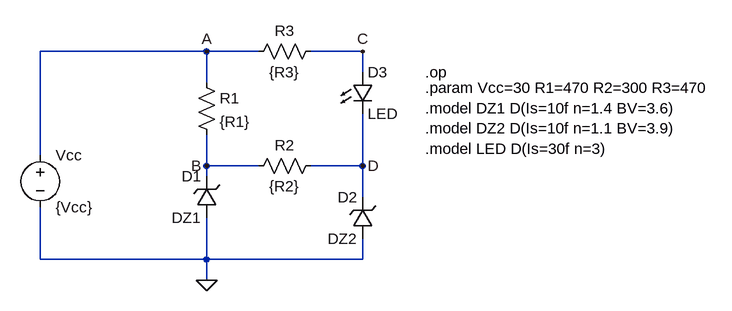
[diagram p0: schematic Lab EaD 01 E.asc]
Lab EaD 01 E.asc, the LTspice schematic file:
Version 4
SHEET 1 1040 680
WIRE 224 -16 -32 -16
WIRE 304 -16 224 -16
WIRE 464 -16 384 -16
WIRE 464 16 464 -16
WIRE 224 32 224 -16
WIRE -32 144 -32 -16
WIRE 224 160 224 112
WIRE 304 160 224 160
WIRE 464 160 464 80
WIRE 464 160 384 160
WIRE 224 176 224 160
WIRE 464 208 464 160
WIRE -32 304 -32 224
WIRE 224 304 224 240
WIRE 224 304 -32 304
WIRE 464 304 464 272
WIRE 464 304 224 304
WIRE 224 336 224 304
FLAG 224 336 0
FLAG 224 -16 A
FLAG 224 160 B
FLAG 464 -16 C
FLAG 464 160 D
SYMBOL voltage -32 128 R0
SYMATTR InstName Vcc
SYMATTR Value {Vcc}
SYMBOL zener 240 240 R180
WINDOW 0 24 64 Left 2
WINDOW 3 24 0 Left 2
SYMATTR InstName D1
SYMATTR Value DZ1
SYMBOL res 288 176 R270
WINDOW 0 32 56 VTop 2
WINDOW 3 0 56 VBottom 2
SYMATTR InstName R2
SYMATTR Value {R2}
SYMBOL res 208 16 R0
SYMATTR InstName R1
SYMATTR Value {R1}
SYMBOL res 400 -32 R90
WINDOW 0 0 56 VBottom 2
WINDOW 3 32 56 VTop 2
SYMATTR InstName R3
SYMATTR Value {R3}
SYMBOL LED 448 16 R0
SYMATTR InstName D3
SYMATTR Value LED
SYMBOL zener 480 272 R180
WINDOW 0 24 64 Left 2
WINDOW 3 24 0 Left 2
SYMATTR InstName D2
SYMATTR Value DZ2
TEXT 560 16 Left 2 !.op
TEXT 560 40 Left 2 !.param Vcc=30 R1=470 R2=300 R3=470\n.model DZ1 D(Is=10f n=1.4 BV=3.6)\n.model DZ2 D(Is=10f n=1.1 BV=3.9)\n.model LED D(Is=30f n=3)

The netlist it stands for:
* Lab EaD 01 E.asc
Vcc A 0 {Vcc}
D1 0 B DZ1
R2 B D {R2}
R1 A B {R1}
R3 C A {R3}
D3 C D LED
D2 0 D DZ2
.model D D
.lib standard.dio
.op
.param Vcc=30 R1=470 R2=300 R3=470
.model DZ1 D(Is=10f n=1.4 BV=3.6)
.model DZ2 D(Is=10f n=1.1 BV=3.9)
.model LED D(Is=30f n=3)
.backanno
.end

* Results of the author's LTspice run, read from the files saved beside the schematic
* Operating Point:
*   V(a) = 30 V
*   V(b) = 4.121 V
*   V(d) = 4.417 V
*   V(c) = 6.601 V
*   I(D2) = -48.8 mA
*   I(D3) = 49.79 mA
*   I(D1) = -56.05 mA
*   I(R3) = -49.79 mA
*   I(R1) = 55.06 mA
*   I(R2) = -988.1 µA
*   I(Vcc) = -104.8 mA
* From the log:
*   Semiconductor Device Operating Points:
*                           --- Diodes ---
*   Name:      d2          d3          d1
*   Model:     dz2         led         dz1
*   Id:     -4.88e-02    4.98e-02   -5.60e-02
*   Vd:     -4.42e+00    2.18e+00   -4.12e+00
*   Req:     5.30e-01    1.56e+00    4.61e-01
*   CAP:     0.00e+00    0.00e+00    0.00e+00